# Altium schematic sheet Banks_7_8.SchDoc: FPGA Motherboard for Digital Multiplexed Readout, McGill U.
size B; DocumentNumber: DfMUX5; Revision: Rev0, Prototype; SheetNumber: 5; SheetTotal: 27; PageSetup: Record=PageOptions|CenterHorizontal=True|CenterVertical=True|PrintScale=1.08|XCorrection=1.00|YCorrection=1.00|PrintKind=0|BorderSize=5000000|LeftOffset=0|BottomOffset=0|Orientation=2|PaperLength=1000|PaperWidth=1000|Scale=100|PaperSource=7|PrintQuality=-4|MediaType=1|DitherType=10|PaperKind=Tabloid|PrintScaleMode=1
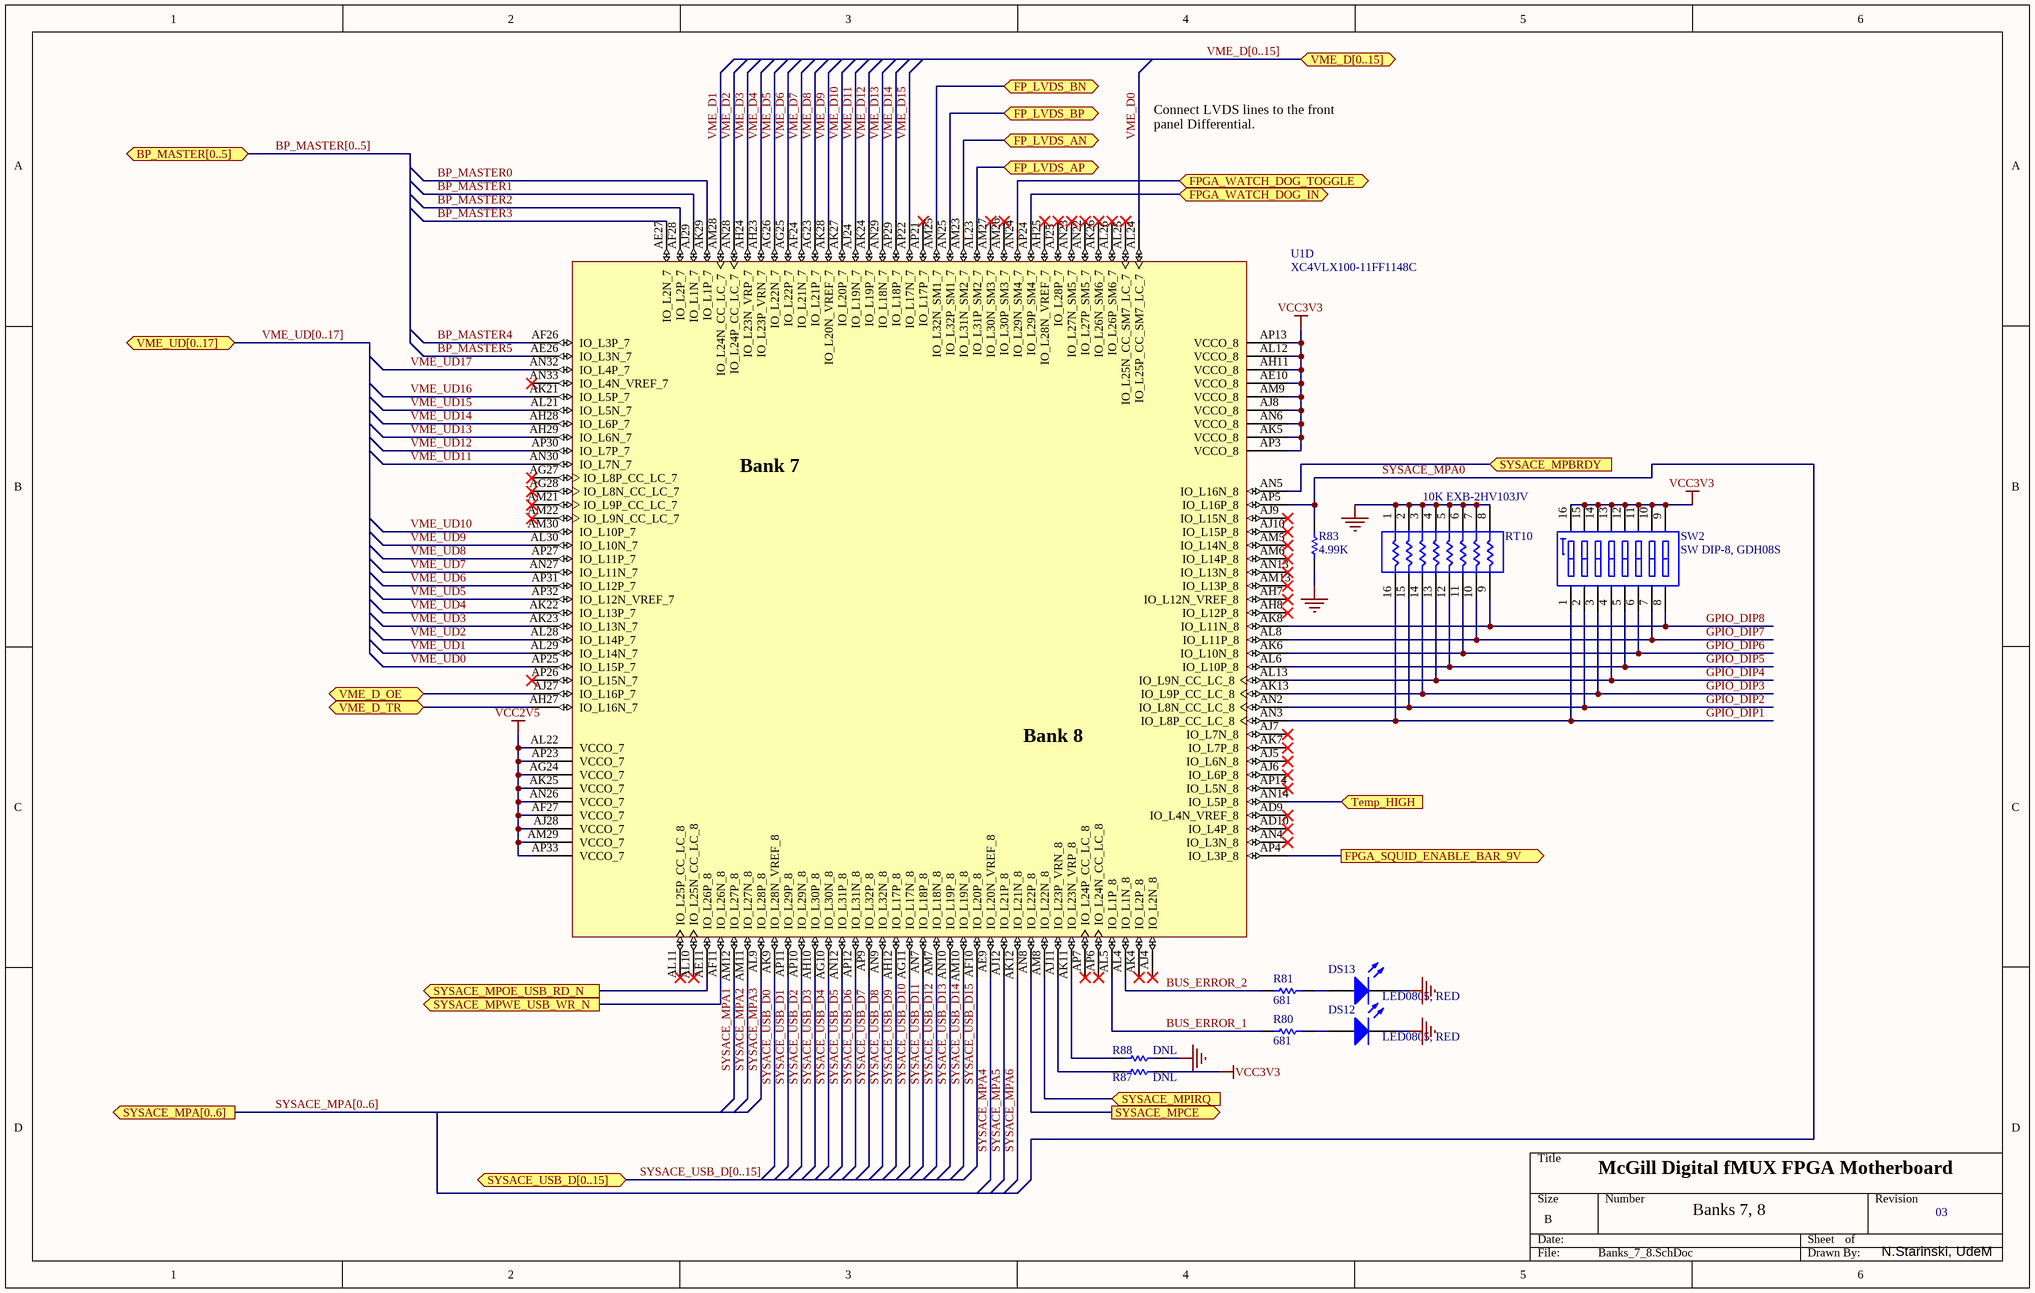
[diagram p0: Banks_7_8.SchDoc]

## Parts
DS12  LED0805, RED  [SMD _LED]
DS13  LED0805, RED  [SMD _LED]
R80  681  [CR1608-0603]
R81  681  [CR1608-0603]
R83  4.99K  [CR1608-0603]
R87  DNL  [CR1608-0603]
R88  DNL  [CR1608-0603]
RT10  10K EXB-2HV103JV  [0402_Array_2HV]
SW2  SW DIP-8, GDH08S  [DIP_SW_8WAY_SMD]
U1  XC4VLX100-11FF1148C  [FF1148]  (part D of 10)

## Ports
BP_MASTER[0..5], FP_LVDS_AN (bidir), FP_LVDS_AP (bidir), FP_LVDS_BN (bidir), FP_LVDS_BP (bidir), FPGA_SQUID_ENABLE_BAR_9V (out), FPGA_WATCH_DOG_IN (bidir), FPGA_WATCH_DOG_TOGGLE (bidir), SYSACE_MPA[0..6] (out), SYSACE_MPBRDY (in), SYSACE_MPCE (out), SYSACE_MPIRQ (in), SYSACE_MPOE_USB_RD_N (out), SYSACE_MPWE_USB_WR_N (out), SYSACE_USB_D[0..15], Temp_HIGH (in), VME_D[0..15] (bidir), VME_D_OE (bidir), VME_D_TR (bidir), VME_UD[0..17] (bidir)

## Nets
GND: DS12.2(K) DS13.2(K) R83.1 R88.2 RT10.1 RT10.2 RT10.3 RT10.4 RT10.5 RT10.6 RT10.7 RT10.8
VCC2V5: U1.AF27(VCCO_7) U1.AG24(VCCO_7) U1.AJ28(VCCO_7) U1.AK25(VCCO_7) U1.AL22(VCCO_7) U1.AM29(VCCO_7) U1.AN26(VCCO_7) U1.AP23(VCCO_7) U1.AP33(VCCO_7)
VCC3V3: R87.2 SW2.9(B8) SW2.10(B7) SW2.11(B6) SW2.12(B5) SW2.13(B4) SW2.14(B3) SW2.15(B2) SW2.16(B1) U1.AE10(VCCO_8) U1.AH11(VCCO_8) U1.AJ8(VCCO_8) U1.AK5(VCCO_8) U1.AL12(VCCO_8) U1.AM9(VCCO_8) U1.AN6(VCCO_8) U1.AP3(VCCO_8) U1.AP13(VCCO_8)
BP_MASTER0: U1.AK29(IO_L1P_7)
BP_MASTER1: U1.AJ29(IO_L1N_7)
BP_MASTER2: U1.AF28(IO_L2P_7)
BP_MASTER3: U1.AE27(IO_L2N_7)
BP_MASTER4: U1.AF26(IO_L3P_7)
BP_MASTER5: U1.AE26(IO_L3N_7)
BUS_ERROR_1: R80.1 U1.AL5(IO_L1P_8)
BUS_ERROR_2: R81.1 U1.AL4(IO_L1N_8)
FP_LVDS_AN: U1.AM23(IO_L31N_SM2_7) ; port FP_LVDS_AN
FP_LVDS_AP: U1.AL23(IO_L31P_SM2_7) ; port FP_LVDS_AP
FP_LVDS_BN: U1.AM25(IO_L32N_SM1_7) ; port FP_LVDS_BN
FP_LVDS_BP: U1.AN25(IO_L32P_SM1_7) ; port FP_LVDS_BP
FPGA_SQUID_ENABLE_BAR_9V: U1.AP4(IO_L3P_8) ; port FPGA_SQUID_ENABLE_BAR_9V
FPGA_WATCH_DOG_IN: U1.AP24(IO_L29P_SM4_7) ; port FPGA_WATCH_DOG_IN
FPGA_WATCH_DOG_TOGGLE: U1.AN24(IO_L29N_SM4_7) ; port FPGA_WATCH_DOG_TOGGLE
GPIO_DIP1: RT10.16 SW2.1(A1) U1.AN3(IO_L8P_CC_LC_8)
GPIO_DIP2: RT10.15 SW2.2(A2) U1.AN2(IO_L8N_CC_LC_8)
GPIO_DIP3: RT10.14 SW2.3(A3) U1.AK13(IO_L9P_CC_LC_8)
GPIO_DIP4: RT10.13 SW2.4(A4) U1.AL13(IO_L9N_CC_LC_8)
GPIO_DIP5: RT10.12 SW2.5(A5) U1.AL6(IO_L10P_8)
GPIO_DIP6: RT10.11 SW2.6(A6) U1.AK6(IO_L10N_8)
GPIO_DIP7: RT10.10 SW2.7(A7) U1.AL8(IO_L11P_8)
GPIO_DIP8: RT10.9 SW2.8(A8) U1.AK8(IO_L11N_8)
SYSACE_MPA0: R83.2 U1.AP5(IO_L16P_8)
SYSACE_MPA1: U1.AM12(IO_L27P_8)
SYSACE_MPA2: U1.AM11(IO_L27N_8)
SYSACE_MPA3: U1.AL9(IO_L28P_8)
SYSACE_MPA4: U1.AE9(IO_L20N_VREF_8)
SYSACE_MPA5: U1.AJ12(IO_L21P_8)
SYSACE_MPA6: U1.AK12(IO_L21N_8)
SYSACE_MPBRDY: U1.AN5(IO_L16N_8) ; port SYSACE_MPBRDY
SYSACE_MPCE: U1.AN8(IO_L22P_8) ; port SYSACE_MPCE
SYSACE_MPIRQ: U1.AM8(IO_L22N_8) ; port SYSACE_MPIRQ
SYSACE_MPOE_USB_RD_N: U1.AE11(IO_L26P_8) ; port SYSACE_MPOE_USB_RD_N
SYSACE_MPWE_USB_WR_N: U1.AF11(IO_L26N_8) ; port SYSACE_MPWE_USB_WR_N
SYSACE_USB_D0: U1.AK9(IO_L28N_VREF_8)
SYSACE_USB_D1: U1.AP11(IO_L29P_8)
SYSACE_USB_D2: U1.AP10(IO_L29N_8)
SYSACE_USB_D3: U1.AH10(IO_L30P_8)
SYSACE_USB_D4: U1.AG10(IO_L30N_8)
SYSACE_USB_D5: U1.AN12(IO_L31P_8)
SYSACE_USB_D6: U1.AP12(IO_L31N_8)
SYSACE_USB_D7: U1.AP9(IO_L32P_8)
SYSACE_USB_D8: U1.AN9(IO_L32N_8)
SYSACE_USB_D9: U1.AH12(IO_L17P_8)
SYSACE_USB_D10: U1.AG11(IO_L17N_8)
SYSACE_USB_D11: U1.AN7(IO_L18P_8)
SYSACE_USB_D12: U1.AM7(IO_L18N_8)
SYSACE_USB_D13: U1.AN10(IO_L19P_8)
SYSACE_USB_D14: U1.AM10(IO_L19N_8)
SYSACE_USB_D15: U1.AF10(IO_L20P_8)
Temp_HIGH: U1.AN14(IO_L5P_8) ; port Temp_HIGH
VME_D0: U1.AL24(IO_L25P_CC_SM7_LC_7)
VME_D1: U1.AM28(IO_L24N_CC_LC_7)
VME_D2: U1.AN28(IO_L24P_CC_LC_7)
VME_D3: U1.AH24(IO_L23N_VRP_7)
VME_D4: U1.AH23(IO_L23P_VRN_7)
VME_D5: U1.AG26(IO_L22N_7)
VME_D6: U1.AG25(IO_L22P_7)
VME_D7: U1.AF24(IO_L21N_7)
VME_D8: U1.AG23(IO_L21P_7)
VME_D9: U1.AK28(IO_L20N_VREF_7)
VME_D10: U1.AK27(IO_L20P_7)
VME_D11: U1.AJ24(IO_L19N_7)
VME_D12: U1.AK24(IO_L19P_7)
VME_D13: U1.AN29(IO_L18N_7)
VME_D14: U1.AP29(IO_L18P_7)
VME_D15: U1.AP22(IO_L17N_7)
VME_D_OE: U1.AJ27(IO_L16P_7) ; port VME_D_OE
VME_D_TR: U1.AH27(IO_L16N_7) ; port VME_D_TR
VME_UD0: U1.AP25(IO_L15P_7)
VME_UD1: U1.AL29(IO_L14N_7)
VME_UD2: U1.AL28(IO_L14P_7)
VME_UD3: U1.AK23(IO_L13N_7)
VME_UD4: U1.AK22(IO_L13P_7)
VME_UD5: U1.AP32(IO_L12N_VREF_7)
VME_UD6: U1.AP31(IO_L12P_7)
VME_UD7: U1.AN27(IO_L11N_7)
VME_UD8: U1.AP27(IO_L11P_7)
VME_UD9: U1.AL30(IO_L10N_7)
VME_UD10: U1.AM30(IO_L10P_7)
VME_UD11: U1.AN30(IO_L7N_7)
VME_UD12: U1.AP30(IO_L7P_7)
VME_UD13: U1.AH29(IO_L6N_7)
VME_UD14: U1.AH28(IO_L6P_7)
VME_UD15: U1.AL21(IO_L5N_7)
VME_UD16: U1.AK21(IO_L5P_7)
VME_UD17: U1.AN32(IO_L4P_7)
NetDS12_1: DS12.1(A) R80.2
NetDS13_1: DS13.1(A) R81.2
NetR87_1: R87.1 U1.AJ11(IO_L23P_VRN_8)
NetR88_1: R88.1 U1.AK11(IO_L23N_VRP_8)

Not connected (* = marked no-connect by the designer): U1 AD9(IO_L4N_VREF_8)* AD10(IO_L4P_8)* AG27(IO_L8P_CC_LC_7)* AG28(IO_L8N_CC_LC_7)* AH7(IO_L12N_VREF_8)* AH8(IO_L12P_8)* AH25(IO_L28N_VREF_7)* AJ4(IO_L2N_8)* AJ5(IO_L6N_8)* AJ6(IO_L6P_8)* AJ7(IO_L7N_8)* AJ9(IO_L15N_8)* AJ10(IO_L15P_8)* AJ25(IO_L28P_7)* AK4(IO_L2P_8)* AK7(IO_L7P_8)* AK26(IO_L26N_SM6_7)* AL10(IO_L25N_CC_LC_8)* AL11(IO_L25P_CC_LC_8)* AL25(IO_L25N_CC_SM7_LC_7)* AL26(IO_L26P_SM6_7)* AM5(IO_L14N_8)* AM6(IO_L14P_8)* AM13(IO_L13P_8)* AM21(IO_L9P_CC_LC_7)* AM22(IO_L9N_CC_LC_7)* AM26(IO_L30P_SM3_7)* AM27(IO_L30N_SM3_7)* AN4(IO_L3N_8)* AN13(IO_L13N_8)* AN22(IO_L27P_SM5_7)* AN23(IO_L27N_SM5_7)* AN33(IO_L4N_VREF_7)* AP6(IO_L24N_CC_LC_8)* AP7(IO_L24P_CC_LC_8)* AP14(IO_L5N_8)* AP21(IO_L17P_7)* AP26(IO_L15N_7)*

## Buses and harness runs
bus BP_MASTER[0..5] = port BP_MASTER[0..5]
bus SYSACE_MPA[0..6] = port SYSACE_MPA[0..6]
bus SYSACE_USB_D[0..15] = port SYSACE_USB_D[0..15]
bus VME_D[0..15] = port VME_D[0..15]
bus VME_UD[0..17] = port VME_UD[0..17]

## Notes on the sheet
- Connect LVDS lines to the front panel Differential.
- McGill Digital fMUX FPGA Motherboard
- Banks 7, 8
- 03
- N.Starinski, UdeM
- (in symbol XC4VLX100-11FF1148C, part D) Bank 7; Bank 8

## Library data of the parts
DS12 DS13 = LED3: LED 0805 LTST-C170CKT; Published: 8-Jun-2000; LatestRevisionDate: 17-Dec-2003; LatestRevisionNote: PCB Footprint replaced.; Publisher: Altium Limited
R80 R81 R83 = Res Semi: Resistor 0603; Published: 8-Jun-2000; LatestRevisionDate: 17-Jul-2002; LatestRevisionNote: Re-released for DXP Platform.; Publisher: Altium Limited
R87 R88 = Res Semi: Semiconductor Resistor; Published: 8-Jun-2000; LatestRevisionDate: 17-Jul-2002; LatestRevisionNote: Re-released for DXP Platform.; Publisher: Altium Limited
RT10 = Res Pack3: Isolated Resistor Network; Published: 24-Mar-1999; LatestRevisionDate: 17-Jul-2002; LatestRevisionNote: Re-released for DXP Platform.; Publisher: Altium Limited
SW2 = SW DIP-8: DIP Switch, 8 Position, SPST; Published: 24-Mar-1999; LatestRevisionDate: 17-Jul-2002; LatestRevisionNote: Re-released for DXP Platform.; Publisher: Altium Limited
U1 = XC4VLX100-11FF1148C: Xilinx Virtex-4 LX Platform FPGA, 1148-Ball FFBGA, Speed Grade 11, 768 User I/Os, Commercial Grade; PackageDocument: ver1.0, Oct-2002; Published: 13-Dec-2004; LatestRevisionDate: 4-Mar-2005; LatestRevisionNote: D_IN & CS_B pins changed from I/O to Input. DOUT_BUSY pin changed from I/O to Output.; DatasheetDocument: ver1.2, Dec-2004; PackageReference: FF1148; Publisher: Altium Limited; ComponentLink2Description: Virtex-4 Overview; ComponentLink2URL: http://www.xilinx.com/products/virtex4/overview.htm; ComponentLink3Description: Datasheet; ComponentLink3URL: http://direct.xilinx.com/bvdocs/userguides/ug075.pdf; Code_JEDEC: MS-034-AAR-1